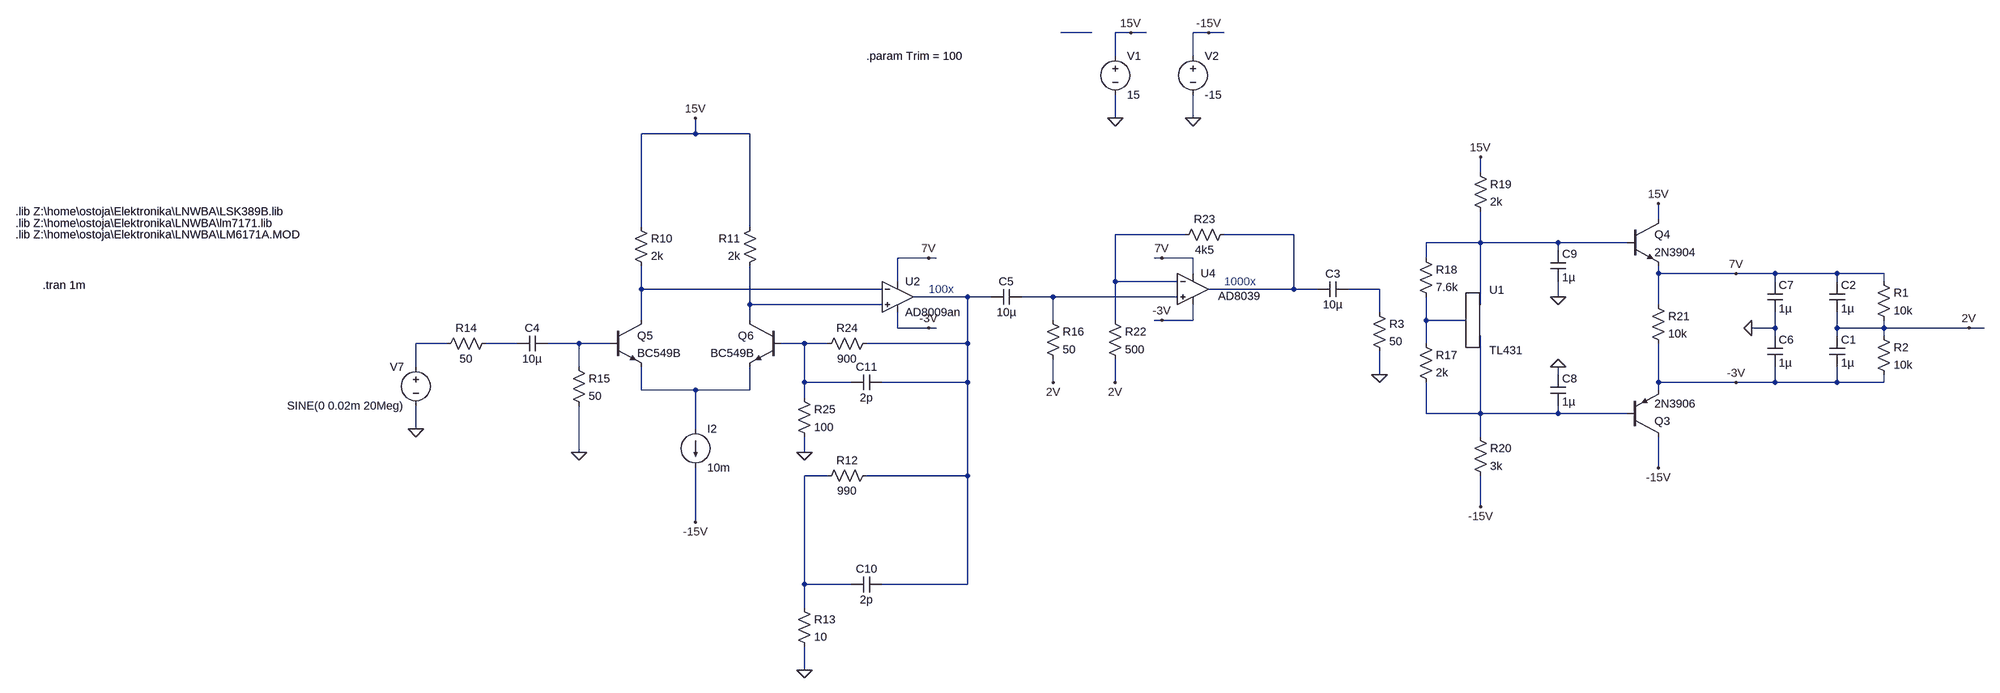
[diagram p0: schematic LNWBA_bjt.asc]
LNWBA_bjt.asc, the LTspice schematic file:
Version 4
SHEET 1 3432 2884
WIRE 1024 -592 960 -592
WIRE 1104 -592 1072 -592
WIRE 1136 -592 1104 -592
WIRE 1264 -592 1232 -592
WIRE 1296 -592 1264 -592
WIRE 1072 -544 1072 -592
WIRE 1232 -544 1232 -592
WIRE 1072 -416 1072 -464
WIRE 1232 -416 1232 -464
WIRE 208 -384 208 -416
WIRE 208 -384 96 -384
WIRE 320 -384 208 -384
WIRE 1824 -304 1824 -336
WIRE 2192 -208 2192 -240
WIRE 96 -192 96 -384
WIRE 320 -192 320 -384
WIRE 1216 -176 1072 -176
WIRE 1440 -176 1296 -176
WIRE 1824 -160 1824 -224
WIRE 1824 -160 1712 -160
WIRE 1984 -160 1824 -160
WIRE 2128 -160 1984 -160
WIRE 1984 -144 1984 -160
WIRE 688 -128 624 -128
WIRE 704 -128 688 -128
WIRE 1168 -128 1152 -128
WIRE 1232 -128 1168 -128
WIRE 1712 -128 1712 -160
WIRE 1232 -96 1232 -128
WIRE 2192 -96 2192 -112
WIRE 2352 -96 2192 -96
WIRE 2432 -96 2352 -96
WIRE 2560 -96 2432 -96
WIRE 2656 -96 2560 -96
WIRE 624 -80 624 -128
WIRE 1072 -80 1072 -176
WIRE 1200 -80 1072 -80
WIRE 2432 -80 2432 -96
WIRE 2560 -80 2560 -96
WIRE 2656 -80 2656 -96
WIRE 96 -64 96 -112
WIRE 592 -64 96 -64
WIRE 1440 -64 1440 -176
WIRE 1440 -64 1264 -64
WIRE 1488 -64 1440 -64
WIRE 1616 -64 1552 -64
WIRE 768 -48 656 -48
WIRE 816 -48 768 -48
WIRE 944 -48 880 -48
WIRE 1200 -48 944 -48
WIRE 1984 -48 1984 -80
WIRE 320 -32 320 -112
WIRE 592 -32 320 -32
WIRE 1824 -32 1824 -160
WIRE 2192 -32 2192 -96
WIRE 1616 -16 1616 -64
WIRE 96 0 96 -64
WIRE 320 0 320 -32
WIRE 944 0 944 -48
WIRE 1072 0 1072 -80
WIRE 1168 0 1152 0
WIRE 1232 0 1232 -32
WIRE 1232 0 1168 0
WIRE 1712 0 1712 -48
WIRE 1792 0 1712 0
WIRE 624 16 624 -16
WIRE 688 16 624 16
WIRE 704 16 688 16
WIRE 2432 16 2432 -16
WIRE 2432 16 2384 16
WIRE 2560 16 2560 -16
WIRE 2656 16 2656 0
WIRE 2656 16 2560 16
WIRE 2848 16 2656 16
WIRE 2880 16 2848 16
WIRE 2432 32 2432 16
WIRE 2560 32 2560 16
WIRE 2656 32 2656 16
WIRE -304 48 -368 48
WIRE -160 48 -224 48
WIRE -32 48 -96 48
WIRE 32 48 -32 48
WIRE 432 48 384 48
WIRE 480 48 432 48
WIRE 768 48 768 -48
WIRE 768 48 560 48
WIRE 1712 48 1712 0
WIRE -368 96 -368 48
WIRE -32 96 -32 48
WIRE 1616 112 1616 64
WIRE 1984 112 1984 96
WIRE 432 128 432 48
WIRE 528 128 432 128
WIRE 768 128 768 48
WIRE 768 128 592 128
WIRE 944 128 944 80
WIRE 1072 128 1072 80
WIRE 2192 128 2192 48
WIRE 2352 128 2192 128
WIRE 2432 128 2432 96
WIRE 2432 128 2352 128
WIRE 2560 128 2560 96
WIRE 2560 128 2432 128
WIRE 2656 128 2656 112
WIRE 2656 128 2560 128
WIRE 96 144 96 96
WIRE 208 144 96 144
WIRE 320 144 320 96
WIRE 320 144 208 144
WIRE 2192 144 2192 128
WIRE 432 160 432 128
WIRE 1712 192 1712 128
WIRE 1824 192 1824 32
WIRE 1824 192 1712 192
WIRE 1984 192 1984 176
WIRE 1984 192 1824 192
WIRE 2128 192 1984 192
WIRE -368 224 -368 176
WIRE 208 224 208 144
WIRE 1824 240 1824 192
WIRE -32 272 -32 176
WIRE 432 272 432 240
WIRE 2192 304 2192 240
WIRE 480 320 432 320
WIRE 768 320 768 128
WIRE 768 320 560 320
WIRE 1824 384 1824 320
WIRE 208 416 208 304
WIRE 432 544 432 320
WIRE 528 544 432 544
WIRE 768 544 768 320
WIRE 768 544 592 544
WIRE 432 592 432 544
WIRE 432 720 432 672
FLAG 1104 -592 15V
FLAG 1264 -592 -15V
FLAG 1232 -416 0
FLAG 1072 -416 0
FLAG 208 -416 15V
FLAG 208 416 -15V
FLAG -368 224 0
FLAG 432 720 0
FLAG -32 272 0
FLAG 1824 -336 15V
FLAG 1824 384 -15V
FLAG 2192 304 -15V
FLAG 2192 -240 15V
FLAG 2352 -96 7V
FLAG 2352 128 -3V
FLAG 688 -128 7V
FLAG 688 16 -3V
FLAG 2384 16 0
FLAG 1984 96 0
FLAG 1984 -48 0
FLAG 432 272 0
FLAG 1168 -128 7V
FLAG 1168 0 -3V
FLAG 2848 16 2V
FLAG 944 128 2V
FLAG 1072 128 2V
FLAG 1616 112 0
SYMBOL voltage 1072 -560 R0
WINDOW 123 0 0 Left 0
WINDOW 39 0 0 Left 0
SYMATTR InstName V1
SYMATTR Value 15
SYMBOL voltage 1232 -560 R0
WINDOW 123 0 0 Left 0
WINDOW 39 0 0 Left 0
SYMATTR InstName V2
SYMATTR Value -15
SYMBOL voltage -368 80 M0
WINDOW 123 0 0 Left 0
WINDOW 39 0 0 Left 0
SYMATTR InstName V7
SYMATTR Value SINE(0 0.02m 20Meg)
SYMBOL res 80 -208 R0
SYMATTR InstName R10
SYMATTR Value 2k
SYMBOL res 336 -208 M0
SYMATTR InstName R11
SYMATTR Value 2k
SYMBOL res 576 304 R90
WINDOW 0 0 56 VBottom 2
WINDOW 3 32 56 VTop 2
SYMATTR InstName R12
SYMATTR Value 990
SYMBOL res 416 576 R0
SYMATTR InstName R13
SYMATTR Value 10
SYMBOL cap -96 32 R90
WINDOW 0 0 32 VBottom 2
WINDOW 3 32 32 VTop 2
SYMATTR InstName C4
SYMATTR Value 10µ
SYMBOL res -208 32 R90
WINDOW 0 0 56 VBottom 2
WINDOW 3 32 56 VTop 2
SYMATTR InstName R14
SYMATTR Value 50
SYMBOL res -48 80 R0
SYMATTR InstName R15
SYMATTR Value 50
SYMBOL cap 880 -64 R90
WINDOW 0 0 32 VBottom 2
WINDOW 3 32 32 VTop 2
SYMATTR InstName C5
SYMATTR Value 10µ
SYMBOL res 928 -16 R0
SYMATTR InstName R16
SYMATTR Value 50
SYMBOL current 208 224 R0
WINDOW 123 0 0 Left 0
WINDOW 39 0 0 Left 0
SYMATTR InstName I2
SYMATTR Value 10m
SYMBOL ZZZ\\REF\\TL431 1808 -32 R0
SYMATTR InstName U1
SYMBOL res 1696 32 R0
SYMATTR InstName R17
SYMATTR Value 2k
SYMBOL res 1696 -144 R0
SYMATTR InstName R18
SYMATTR Value 7.6k
SYMBOL res 1808 -320 R0
SYMATTR InstName R19
SYMATTR Value 2k
SYMBOL res 1808 224 R0
SYMATTR InstName R20
SYMATTR Value 3k
SYMBOL pnp 2128 240 M180
SYMATTR InstName Q3
SYMATTR Value 2N3906
SYMBOL res 2176 -48 R0
SYMATTR InstName R21
SYMATTR Value 10k
SYMBOL npn 2128 -208 R0
SYMATTR InstName Q4
SYMATTR Value 2N3904
SYMBOL cap 2416 32 R0
SYMATTR InstName C6
SYMATTR Value 1µ
SYMBOL cap 2416 -80 R0
SYMATTR InstName C7
SYMATTR Value 1µ
SYMBOL cap 1968 112 R0
SYMATTR InstName C8
SYMATTR Value 1µ
SYMBOL cap 1968 -144 R0
SYMATTR InstName C9
SYMATTR Value 1µ
SYMBOL cap 592 528 R90
WINDOW 0 0 32 VBottom 2
WINDOW 3 32 32 VTop 2
SYMATTR InstName C10
SYMATTR Value 2p
SYMBOL OpAmps\\AD8039 1232 -128 R0
WINDOW 3 52 78 Left 2
SYMATTR InstName U4
SYMBOL res 1056 -16 R0
SYMATTR InstName R22
SYMATTR Value 500
SYMBOL res 1312 -192 R90
WINDOW 0 0 56 VBottom 2
WINDOW 3 32 56 VTop 2
SYMATTR InstName R23
SYMATTR Value 4k5
SYMBOL res 576 32 R90
WINDOW 0 0 56 VBottom 2
WINDOW 3 32 56 VTop 2
SYMATTR InstName R24
SYMATTR Value 900
SYMBOL res 416 144 R0
SYMATTR InstName R25
SYMATTR Value 100
SYMBOL cap 592 112 R90
WINDOW 0 0 32 VBottom 2
WINDOW 3 32 32 VTop 2
SYMATTR InstName C11
SYMATTR Value 2p
SYMBOL npn 32 0 R0
SYMATTR InstName Q5
SYMATTR Value BC549B
SYMBOL npn 384 0 M0
SYMATTR InstName Q6
SYMATTR Value BC549B
SYMBOL cap 2544 32 R0
SYMATTR InstName C1
SYMATTR Value 1µ
SYMBOL cap 2544 -80 R0
SYMATTR InstName C2
SYMATTR Value 1µ
SYMBOL res 2640 -96 R0
SYMATTR InstName R1
SYMATTR Value 10k
SYMBOL res 2640 16 R0
SYMATTR InstName R2
SYMATTR Value 10k
SYMBOL ZZZ\\OpAmp\\AD8009an 624 -48 R0
SYMATTR InstName U2
SYMBOL cap 1552 -80 R90
WINDOW 0 0 32 VBottom 2
WINDOW 3 32 32 VTop 2
SYMATTR InstName C3
SYMATTR Value 10µ
SYMBOL res 1600 -32 R0
SYMATTR InstName R3
SYMATTR Value 50
TEXT -1192 -224 Left 2 !.lib Z:\\home\\ostoja\\Elektronika\\LNWBA\\LSK389B.lib
TEXT -1136 -72 Left 2 !.tran 1m
TEXT -1192 -200 Left 2 !.lib Z:\\home\\ostoja\\Elektronika\\LNWBA\\lm7171.lib
TEXT -1192 -176 Left 2 !.lib Z:\\home\\ostoja\\Elektronika\\LNWBA\\LM6171A.MOD
TEXT 560 -544 Left 2 !.param Trim = 100
TEXT 688 -64 Left 2 ;100x
TEXT 1296 -80 Left 2 ;1000x

The netlist it stands for:
* LNWBA_bjt.asc
V1 15V 0 15
V2 -15V 0 -15
V7 N011 0 SINE(0 0.02m 20Meg)
R10 15V N005 2k
R11 15V N009 2k
R12 N007 N017 990
R13 N017 0 10
C4 N013 N012 10µ
R14 N012 N011 50
R15 N013 0 50
C5 N008 N007 10µ
R16 N008 2V 50
I2 N015 -15V 10m
XU1 N010 N016 N004 TL431
R17 N010 N016 2k
R18 N004 N010 7.6k
R19 15V N004 2k
R20 N016 -15V 3k
Q3 -15V N016 -3V 0 2N3906
R21 7V -3V 10k
Q4 15V N004 7V 0 2N3904
C6 0 -3V 1µ
C7 7V 0 1µ
C8 0 N016 1µ
C9 N004 0 1µ
C10 N007 N017 2p
XU4 N008 N002 7V -3V N003 AD8039  ; pins In+ In- V+ V- OUT
R22 N002 2V 500
R23 N003 N002 4k5
R24 N007 N014 900
R25 N014 0 100
C11 N007 N014 2p
Q5 N005 N013 N015 0 BC549B
Q6 N009 N014 N015 0 BC549B
C1 2V -3V 1µ
C2 7V 2V 1µ
R1 7V 2V 10k
R2 2V -3V 10k
* U2: AD8009an (symbol ZZZ\OpAmp\AD8009an not available, pins judged from their places): In+=N009 In-=N005 V+=7V V-=-3V OUT=N007
C3 N006 N003 10µ
R3 N006 0 50
.model NPN NPN
.model PNP PNP
.lib standard.bjt
.lib Z:\home\ostoja\Elektronika\LNWBA\LSK389B.lib
.tran 1m
.lib Z:\home\ostoja\Elektronika\LNWBA\lm7171.lib
.lib Z:\home\ostoja\Elektronika\LNWBA\LM6171A.MOD
.param Trim = 100
* 100x
* 1000x
.lib TL431.mod
.backanno
.end